# Altium schematic sheet Power Regulator.SchDoc
size 165 x 114 mm
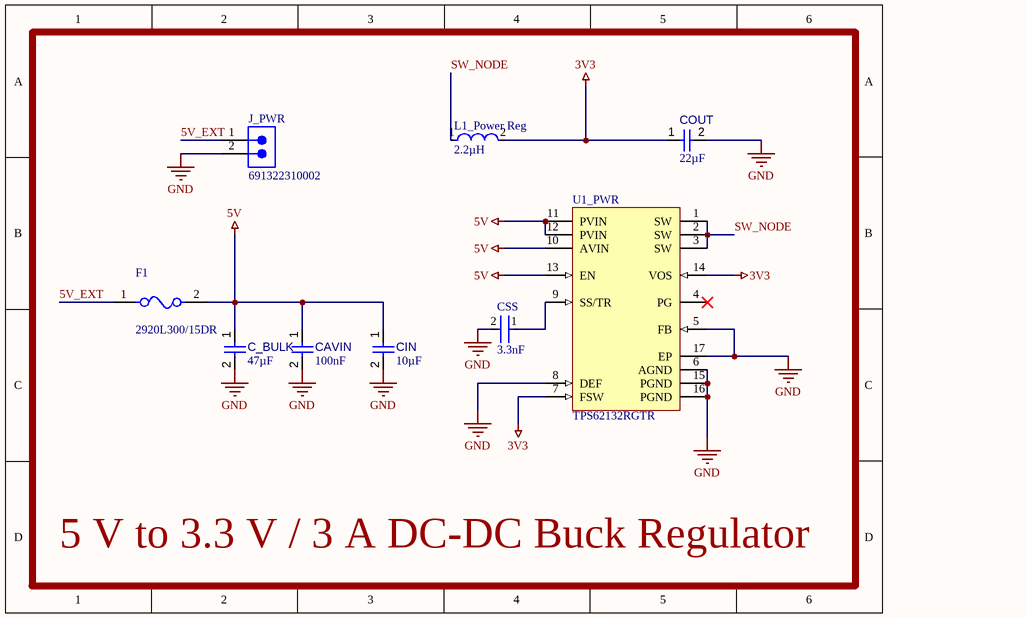
[diagram p0: Power Regulator.SchDoc]

## Parts
C_BULK  value 47µF  [CAPC0805(2012)145_L]  (hidden comment: Capacitor 47µF +/-40% 6.3V 0805)
CAVIN  value 100nF  [CAPC1608X90X40NL10T20]  (hidden comment: Capacitor 100 nF +/-10% 50 V 0603)
CIN  value 10µF  [CAPC2013X135X45NL10T25]  (hidden comment: Capacitor 10 uF +/- 10% 16 V 0805)
COUT  value 22µF  [CAPC0805(2012)145_L]  (hidden comment: Capacitor 22µF +/-40% 16V 0805)
CSS  value 3.3nF  [FP-GCG155-0_1-IPC_A]  (hidden comment: GCG155R71H332KA01D)
F1  2920L300/15DR  [FP-2920L-MFG]
J_PWR  691322310002  [691322310002]
L1_Power_Reg  value 2.2µH  [FP-XFL4020-MFG]  (hidden comment: XFL4020-222MEB)
U1_PWR  TPS62132RGTR  [RGT0016C_V]

## Nets
3V3: COUT.1 L1_Power_Reg.2 U1_PWR.7(FSW) U1_PWR.14(VOS)
5V: C_BULK.1 CAVIN.1 CIN.1 F1.2 U1_PWR.10(AVIN) U1_PWR.11(PVIN) U1_PWR.12(PVIN) U1_PWR.13(EN)
GND: C_BULK.2 CAVIN.2 CIN.2 COUT.2 CSS.2 J_PWR.2 U1_PWR.5(FB) U1_PWR.6(AGND) U1_PWR.8(DEF) U1_PWR.15(PGND) U1_PWR.16(PGND) U1_PWR.17(EP)
5V_EXT: F1.1 J_PWR.1
SW_NODE: L1_Power_Reg.1 U1_PWR.1(SW) U1_PWR.2(SW) U1_PWR.3(SW)
NetCSS_1: CSS.1 U1_PWR.9(SS/TR)

Not connected (* = marked no-connect by the designer): U1_PWR 4(PG)*

## Notes on the sheet
- 5 V to 3.3 V / 3 A DC-DC Buck Regulator

## Library data of the parts
C_BULK = CMP-001-00082-4: Chip Capacitor, 47µF +/-40%, 6.3V, 0805, Thickness 1.45 mm; Tolerance: 10%; Min Operating Temperature: -55°C; Max Operating Temperature: 85°C; Case/Package: 0805; Pins: 2; Mounting Technology: SMT; Voltage Rating: 6.3V
CAVIN = CMP-001-00017-6: Chip Capacitor, 100 nF, +/- 10%, 50 V, 0603 (1608 Metric); Voltage Rating: 50V; Capacitor Type: Ceramic; Tolerance: 10%; Mounting Technology: SM; Max Operating Temperature: 125°C; RoHS Compliant: True; Pins: 2; Case/Package: 0603; Min Operating Temperature: -55°C
CIN = CMP-001-00015-6: Chip Capacitor, 10 uF, +/- 10%, 16 V, 0805 (2012 Metric); Voltage Rating: 16V; Capacitor Type: Ceramic; RoHS Compliant: True; Max Operating Temperature: 85°C; Min Operating Temperature: -55°C; Mounting Technology: SM; Tolerance: 10%; Case/Package: 0805; Pins: 2
COUT = CMP-001-00081-4: Chip Capacitor, 22µF +/-40%, 16V, 0805, Thickness 1.45 mm; Tolerance: 5%; Voltage Rating: 16V; Mounting Technology: SMT; Pins: 2; Max Operating Temperature: 85°C; Case/Package: 0805; Min Operating Temperature: -55°C
CSS = CMP-001-00086-1: Ceramic Capacitor, YES, Ceramic, 50V, 10% +Tol, 10% -Tol, X7R, 15% TC, 0.0033uF, Surface Mount, 1005M/0402; Manufacturer Lifecycle Status: IN PRODUCTION; Case/Package: 0402; Voltage Rating: 50V; Number of Terminals: 2; RoHS: Compliant; Harmonized Tariff Schedule (HTS) Code: 8532.24.00.20; REACH SVHC: Yes; Width: 500µm; Material: Ceramic; Mounting Technology: Surface Mount; Max Operating Temperature: 125°C; Lifecycle Status: Production; Dielectric: X7R; Voltage Rating (DC): 50V; Export Control Classification Number (ECCN) Code: EAR99; Min Operating Temperature: -55°C; Ratings: AEC-Q200; Length: 1mm; Introduction Date: 2013-11-20; Height: 500µm; Dielectric Material: Ceramic; Thickness: 500µm
F1 = CMP-005-00013-1: PTC fuse, self-resetting, SMD 2920, 15 V (DC), 40 A, 5 A (trip), 3 A (hold), 2920L300/15DR; Power Dissipation: 1.5W; Max Current Rating: 40A; Operating Supply Voltage: 15V; Approvals: TUV, cULus; Time to Trip: 20s; Trip Current: 5A; Ratings: TUV; Hold Current: 3A; Minimum Resistance Initial (Rmin): 15mΩ; Value: 15mΩ; Maximum Resistance 1 Hour (R1max): 48mΩ; Termination: SMD/SMT; Case/Package: 2920; Harmonized Tariff Schedule (HTS) Code: 8533.40.80.70; Mounting Technology: Surface Mount; Width: 5.44mm; Min Operating Temperature: -40°C; China RoHS: Compliant; REACH SVHC: Yes; Ambient Temperature Range High: 85°C; Case Code (Imperial): 2920; Number of Terminals: 2; Length: 7.98mm; Lead Free: Lead Free; Introduction Date: 2006-06-15; Working Voltage: 15V; Height: 1.25mm; Voltage Rating (DC): 15V; Max Operating Temperature: 85°C; Lifecycle Status: Production; Current Rating: 40A; Export Control Classification Number (ECCN) Code: EAR99; RoHS: Compliant; Voltage Rating: 15V; Max Voltage Rating (DC): 15V; Case Code (Metric): 7351
J_PWR = CMP-002-00077-1: Terminal Block, Header, 2Ways, Th R/A;; Manufacturer Lifecycle Status: ACTIVE; Current: 10A; Number of Levels: 1; YEOL: 1 = Estimated lifetime > 10 years; Voltage: 300V; Number of Contacts: 2; Gender: Male; Pitch: 3.81mm; RoHS: Compliant; Termination: Solder; Pins: 2; Lead Pitch: 3.81mm; Packaging: Box; Contact Plating: Tin; Number of Rows: 1; Voltage Rating: 300V; Current Rating: 10A; Lifecycle Status: Production; Min Operating Temperature: -40°C; Length: 8.81mm; Contact Material: Tin; Width: 9.01mm; Number of Positions Per Level: 2; Mounting Technology: Through Hole; Color: Green; Height: 7.2mm; Max Operating Temperature: 105°C
L1_Power_Reg = CMP-006-00022-1: General Purpose Inductor, 2.2uH, 20%, 1 Element, Composite-Core, SMD, 1616; ESR: 23.5mΩ; RMS Current (Irms): 8A; Self Resonant Frequency: 38MHz; Shielding: Shielded; Test Frequency: 1MHz; Number of Circuits: 1; Saturation Current: 3.1A; REACH SVHC: Yes; Ambient Temperature Range High: 125°C; RoHS: Compliant; Height: 2.1mm; DC Resistance (DCR): 23.5mΩ; Max DC Current: 8A; Max Current Rating: 8A; Width: 4mm; Ratings: AEC-Q200; Tolerance: 20%; Core Material: Composite; Case/Package: 1616; Max Operating Temperature: 125°C; Min Operating Temperature: -40°C; Termination: SMD/SMT; Lead Free: Contains Lead; Length: 4mm; Lifecycle Status: Obsolete; Number of Terminals: 2
U1_PWR = CMP-011-00013-1: 3-17V 3A Step-Down Converter in 3x3 QFN Package 16-VQFN -40 to 125; Manufacturer Lifecycle Status: ACTIVE; Number of Outputs: 1; Output Voltage: 3.3V; Max Supply Voltage: 17V; Quiescent Current: 17µA; Synchronous Rectifier: Yes; Output Configuration: Positive; Min Input Voltage: 3V; Output Type: Fixed; Switching Frequency: 2.5MHz; Topology: Buck; Lifecycle Status: Production; Min Operating Temperature: -40°C; Case/Package: VQFN; Max Output Voltage: 3.3V; Output Current: 3A; RoHS: Compliant; Height: 1mm; Min Output Voltage: 3.3V; Max Output current: 3A; Thickness: 900µm; Max Operating Temperature: 125°C; Schedule B: 8542390000, 8542390000; Lead Free: Lead Free; Length: 3mm; Operating Supply Voltage: 17V; Pins: 16; Width: 3mm